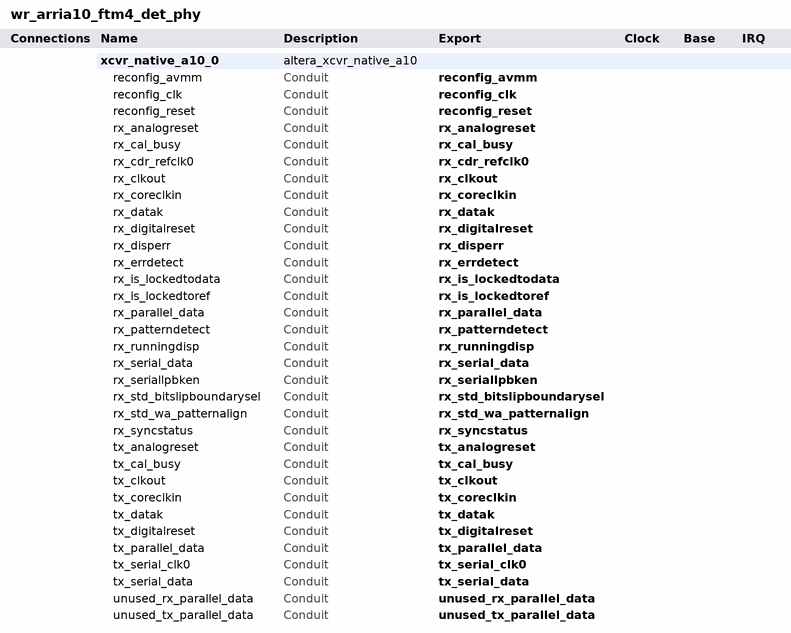
[diagram p0: system contents]
# Platform Designer (Qsys) system wr_arria10_ftm4_det_phy, Arria 10 10AX048E3F29E2SG
# Parameters at their usual value, and those the tool derives, are not listed.
package require -exact qsys 18.1
create_system wr_arria10_ftm4_det_phy
set_project_property DEVICE_FAMILY {Arria 10}
set_project_property DEVICE 10AX048E3F29E2SG

add_instance xcvr_native_a10_0 altera_xcvr_native_a10 18.1
set_instance_property xcvr_native_a10_0 AUTO_EXPORT true
set_instance_parameter_value xcvr_native_a10_0 anlg_voltage 1_0V
set_instance_parameter_value xcvr_native_a10_0 base_device NIGHTFURY2
set_instance_parameter_value xcvr_native_a10_0 bonded_mode not_bonded
set_instance_parameter_value xcvr_native_a10_0 channels 1
set_instance_parameter_value xcvr_native_a10_0 disable_continuous_dfe false
set_instance_parameter_value xcvr_native_a10_0 enable_pcie_data_mask_option 0
set_instance_parameter_value xcvr_native_a10_0 enable_pcie_dfe_ip false
set_instance_parameter_value xcvr_native_a10_0 enable_port_rx_analog_reset_ack 0
set_instance_parameter_value xcvr_native_a10_0 enable_port_rx_enh_bitslip 0
set_instance_parameter_value xcvr_native_a10_0 enable_port_rx_enh_blk_lock 0
set_instance_parameter_value xcvr_native_a10_0 enable_port_rx_enh_clr_errblk_count 0
set_instance_parameter_value xcvr_native_a10_0 enable_port_rx_enh_data_valid 0
set_instance_parameter_value xcvr_native_a10_0 enable_port_rx_enh_fifo_full 0
set_instance_parameter_value xcvr_native_a10_0 enable_port_rx_enh_fifo_rd_en 0
set_instance_parameter_value xcvr_native_a10_0 enable_port_rx_pma_clkout 0
set_instance_parameter_value xcvr_native_a10_0 enable_port_rx_pma_div_clkout 0
set_instance_parameter_value xcvr_native_a10_0 enable_port_rx_polinv 0
set_instance_parameter_value xcvr_native_a10_0 enable_port_rx_seriallpbken_tx 1
set_instance_parameter_value xcvr_native_a10_0 enable_port_rx_std_bitslip 0
set_instance_parameter_value xcvr_native_a10_0 enable_port_rx_std_bitslipboundarysel 1
set_instance_parameter_value xcvr_native_a10_0 enable_port_rx_std_wa_patternalign 1
set_instance_parameter_value xcvr_native_a10_0 enable_port_tx_analog_reset_ack 0
set_instance_parameter_value xcvr_native_a10_0 enable_port_tx_enh_fifo_full 0
set_instance_parameter_value xcvr_native_a10_0 enable_port_tx_enh_fifo_pfull 0
set_instance_parameter_value xcvr_native_a10_0 enable_port_tx_pma_clkout 0
set_instance_parameter_value xcvr_native_a10_0 enable_port_tx_pma_div_clkout 0
set_instance_parameter_value xcvr_native_a10_0 enable_port_tx_polinv 0
set_instance_parameter_value xcvr_native_a10_0 enable_ports_rx_manual_cdr_mode 0
set_instance_parameter_value xcvr_native_a10_0 enable_simple_interface 1
set_instance_parameter_value xcvr_native_a10_0 enable_skp_ports 0
set_instance_parameter_value xcvr_native_a10_0 enh_pcs_pma_width 40
set_instance_parameter_value xcvr_native_a10_0 enh_pld_pcs_width 40
set_instance_parameter_value xcvr_native_a10_0 enh_rx_blksync_enable 0
set_instance_parameter_value xcvr_native_a10_0 enh_rx_descram_enable 0
set_instance_parameter_value xcvr_native_a10_0 enh_rxfifo_mode {Phase compensation}
set_instance_parameter_value xcvr_native_a10_0 enh_tx_scram_enable 0
set_instance_parameter_value xcvr_native_a10_0 enh_tx_scram_seed 0
set_instance_parameter_value xcvr_native_a10_0 enh_txfifo_mode {Phase compensation}
set_instance_parameter_value xcvr_native_a10_0 generate_add_hdl_instance_example 0
set_instance_parameter_value xcvr_native_a10_0 generate_docs 0
set_instance_parameter_value xcvr_native_a10_0 protocol_mode cpri_rx_tx
set_instance_parameter_value xcvr_native_a10_0 rcfg_file_prefix altera_xcvr_native_a10
set_instance_parameter_value xcvr_native_a10_0 rcfg_h_file_enable 0
set_instance_parameter_value xcvr_native_a10_0 rcfg_iface_enable 0
set_instance_parameter_value xcvr_native_a10_0 rcfg_jtag_enable 0
set_instance_parameter_value xcvr_native_a10_0 rcfg_mif_file_enable 0
set_instance_parameter_value xcvr_native_a10_0 rcfg_multi_enable 0
set_instance_parameter_value xcvr_native_a10_0 rcfg_profile_cnt 2
set_instance_parameter_value xcvr_native_a10_0 rcfg_profile_select 1
set_instance_parameter_value xcvr_native_a10_0 rcfg_reduced_files_enable 0
set_instance_parameter_value xcvr_native_a10_0 rcfg_separate_avmm_busy 0
set_instance_parameter_value xcvr_native_a10_0 rcfg_shared 0
set_instance_parameter_value xcvr_native_a10_0 rcfg_sv_file_enable 0
set_instance_parameter_value xcvr_native_a10_0 rx_pma_div_clkout_divider 0
set_instance_parameter_value xcvr_native_a10_0 set_capability_reg_enable 0
set_instance_parameter_value xcvr_native_a10_0 set_cdr_refclk_freq 125.000
set_instance_parameter_value xcvr_native_a10_0 set_csr_soft_logic_enable 0
set_instance_parameter_value xcvr_native_a10_0 set_data_rate 1250
set_instance_parameter_value xcvr_native_a10_0 set_disconnect_analog_resets 0
set_instance_parameter_value xcvr_native_a10_0 set_odi_soft_logic_enable 0
set_instance_parameter_value xcvr_native_a10_0 set_prbs_soft_logic_enable 0
set_instance_parameter_value xcvr_native_a10_0 sim_reduced_counters false
set_instance_parameter_value xcvr_native_a10_0 std_data_mask_count_multi 0
set_instance_parameter_value xcvr_native_a10_0 std_pcs_pma_width 10
set_instance_parameter_value xcvr_native_a10_0 std_rx_8b10b_enable 1
set_instance_parameter_value xcvr_native_a10_0 std_rx_byte_deser_mode Disabled
set_instance_parameter_value xcvr_native_a10_0 std_rx_pcfifo_mode register_fifo
set_instance_parameter_value xcvr_native_a10_0 std_rx_polinv_enable 0
set_instance_parameter_value xcvr_native_a10_0 std_rx_word_aligner_mode {manual (PLD controlled)}
set_instance_parameter_value xcvr_native_a10_0 std_rx_word_aligner_pattern 380
set_instance_parameter_value xcvr_native_a10_0 std_rx_word_aligner_pattern_len 10
set_instance_parameter_value xcvr_native_a10_0 std_tx_8b10b_enable 1
set_instance_parameter_value xcvr_native_a10_0 std_tx_byte_ser_mode Disabled
set_instance_parameter_value xcvr_native_a10_0 std_tx_pcfifo_mode register_fifo
set_instance_parameter_value xcvr_native_a10_0 std_tx_polinv_enable 0
set_instance_parameter_value xcvr_native_a10_0 tx_pma_clk_div 4
set_instance_parameter_value xcvr_native_a10_0 tx_pma_div_clkout_divider 0

# exported interfaces
add_interface reconfig_avmm conduit end
set_interface_property reconfig_avmm EXPORT_OF xcvr_native_a10_0.reconfig_avmm
add_interface reconfig_clk conduit end
set_interface_property reconfig_clk EXPORT_OF xcvr_native_a10_0.reconfig_clk
add_interface reconfig_reset conduit end
set_interface_property reconfig_reset EXPORT_OF xcvr_native_a10_0.reconfig_reset
add_interface rx_analogreset conduit end
set_interface_property rx_analogreset EXPORT_OF xcvr_native_a10_0.rx_analogreset
add_interface rx_cal_busy conduit end
set_interface_property rx_cal_busy EXPORT_OF xcvr_native_a10_0.rx_cal_busy
add_interface rx_cdr_refclk0 conduit end
set_interface_property rx_cdr_refclk0 EXPORT_OF xcvr_native_a10_0.rx_cdr_refclk0
add_interface rx_clkout conduit end
set_interface_property rx_clkout EXPORT_OF xcvr_native_a10_0.rx_clkout
add_interface rx_coreclkin conduit end
set_interface_property rx_coreclkin EXPORT_OF xcvr_native_a10_0.rx_coreclkin
add_interface rx_datak conduit end
set_interface_property rx_datak EXPORT_OF xcvr_native_a10_0.rx_datak
add_interface rx_digitalreset conduit end
set_interface_property rx_digitalreset EXPORT_OF xcvr_native_a10_0.rx_digitalreset
add_interface rx_disperr conduit end
set_interface_property rx_disperr EXPORT_OF xcvr_native_a10_0.rx_disperr
add_interface rx_errdetect conduit end
set_interface_property rx_errdetect EXPORT_OF xcvr_native_a10_0.rx_errdetect
add_interface rx_is_lockedtodata conduit end
set_interface_property rx_is_lockedtodata EXPORT_OF xcvr_native_a10_0.rx_is_lockedtodata
add_interface rx_is_lockedtoref conduit end
set_interface_property rx_is_lockedtoref EXPORT_OF xcvr_native_a10_0.rx_is_lockedtoref
add_interface rx_parallel_data conduit end
set_interface_property rx_parallel_data EXPORT_OF xcvr_native_a10_0.rx_parallel_data
add_interface rx_patterndetect conduit end
set_interface_property rx_patterndetect EXPORT_OF xcvr_native_a10_0.rx_patterndetect
add_interface rx_runningdisp conduit end
set_interface_property rx_runningdisp EXPORT_OF xcvr_native_a10_0.rx_runningdisp
add_interface rx_serial_data conduit end
set_interface_property rx_serial_data EXPORT_OF xcvr_native_a10_0.rx_serial_data
add_interface rx_seriallpbken conduit end
set_interface_property rx_seriallpbken EXPORT_OF xcvr_native_a10_0.rx_seriallpbken
add_interface rx_std_bitslipboundarysel conduit end
set_interface_property rx_std_bitslipboundarysel EXPORT_OF xcvr_native_a10_0.rx_std_bitslipboundarysel
add_interface rx_std_wa_patternalign conduit end
set_interface_property rx_std_wa_patternalign EXPORT_OF xcvr_native_a10_0.rx_std_wa_patternalign
add_interface rx_syncstatus conduit end
set_interface_property rx_syncstatus EXPORT_OF xcvr_native_a10_0.rx_syncstatus
add_interface tx_analogreset conduit end
set_interface_property tx_analogreset EXPORT_OF xcvr_native_a10_0.tx_analogreset
add_interface tx_cal_busy conduit end
set_interface_property tx_cal_busy EXPORT_OF xcvr_native_a10_0.tx_cal_busy
add_interface tx_clkout conduit end
set_interface_property tx_clkout EXPORT_OF xcvr_native_a10_0.tx_clkout
add_interface tx_coreclkin conduit end
set_interface_property tx_coreclkin EXPORT_OF xcvr_native_a10_0.tx_coreclkin
add_interface tx_datak conduit end
set_interface_property tx_datak EXPORT_OF xcvr_native_a10_0.tx_datak
add_interface tx_digitalreset conduit end
set_interface_property tx_digitalreset EXPORT_OF xcvr_native_a10_0.tx_digitalreset
add_interface tx_parallel_data conduit end
set_interface_property tx_parallel_data EXPORT_OF xcvr_native_a10_0.tx_parallel_data
add_interface tx_serial_clk0 conduit end
set_interface_property tx_serial_clk0 EXPORT_OF xcvr_native_a10_0.tx_serial_clk0
add_interface tx_serial_data conduit end
set_interface_property tx_serial_data EXPORT_OF xcvr_native_a10_0.tx_serial_data
add_interface unused_rx_parallel_data conduit end
set_interface_property unused_rx_parallel_data EXPORT_OF xcvr_native_a10_0.unused_rx_parallel_data
add_interface unused_tx_parallel_data conduit end
set_interface_property unused_tx_parallel_data EXPORT_OF xcvr_native_a10_0.unused_tx_parallel_data

set_interconnect_requirement {$system} qsys_mm.clockCrossingAdapter HANDSHAKE
set_interconnect_requirement {$system} qsys_mm.enableEccProtection FALSE
set_interconnect_requirement {$system} qsys_mm.insertDefaultSlave FALSE
set_interconnect_requirement {$system} qsys_mm.maxAdditionalLatency 1

save_system wr_arria10_ftm4_det_phy.qsys
